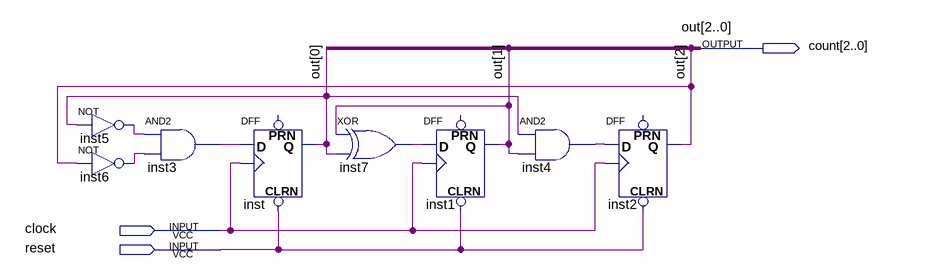
[diagram p0: schematic sheet]
// Quartus schematic Project3.bdf as structural Verilog: 8 symbols, 3 pins
module Project3 (
  input  clock,
  input  reset,
  output [2:0] count
);

  wire inst3_out, inst4_out, inst5_out, inst6_out, inst7_out;

  not inst5 (inst5_out, count[0]);
  not inst6 (inst6_out, count[2]);
  and inst3 (inst3_out, inst5_out, inst6_out);
  DFF inst (.CLRN(reset), .CLK(clock), .D(inst3_out), .Q(count[0]));  // open: PRN
  xor inst7 (inst7_out, count[1], count[0]);
  DFF inst1 (.CLRN(reset), .CLK(clock), .D(inst7_out), .Q(count[1]));  // open: PRN
  and inst4 (inst4_out, count[0], count[1]);
  DFF inst2 (.CLRN(reset), .CLK(clock), .D(inst4_out), .Q(count[2]));  // open: PRN

  // Other names for the same wires on the sheet: out[2:0] = count
endmodule
